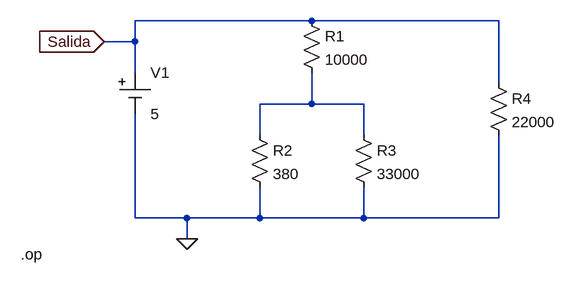
[diagram p0: schematic Circuito del ejercicio 5.asc]
Circuito del ejercicio 5.asc, the LTspice schematic file:
Version 4
SHEET 1 880 680
WIRE 288 -32 16 -32
WIRE 576 -32 288 -32
WIRE 16 0 16 -32
WIRE 16 0 -32 0
WIRE 16 48 16 0
WIRE 576 64 576 -32
WIRE 288 96 288 48
WIRE 288 96 208 96
WIRE 368 96 288 96
WIRE 208 144 208 96
WIRE 368 144 368 96
WIRE 16 272 16 112
WIRE 96 272 16 272
WIRE 208 272 208 224
WIRE 208 272 96 272
WIRE 368 272 368 224
WIRE 368 272 208 272
WIRE 576 272 576 144
WIRE 576 272 368 272
WIRE 96 304 96 272
FLAG 96 304 0
FLAG -32 0 Salida
IOPIN -32 0 In
SYMBOL Misc\\cell 16 48 R0
WINDOW 123 0 0 Left 0
WINDOW 39 0 0 Left 0
SYMATTR InstName V1
SYMATTR Value 5
SYMBOL res 272 -48 R0
SYMATTR InstName R1
SYMATTR Value 10000
SYMBOL res 192 128 R0
SYMATTR InstName R2
SYMATTR Value 380
SYMBOL res 352 128 R0
SYMATTR InstName R3
SYMATTR Value 33000
SYMBOL res 560 48 R0
SYMATTR InstName R4
SYMATTR Value 22000
TEXT -160 328 Left 2 !.op

The netlist it stands for:
* Circuito del ejercicio 5.asc
V1 Salida 0 5
R1 Salida N001 10000
R2 N001 0 380
R3 N001 0 33000
R4 Salida 0 22000
.op
.backanno
.end